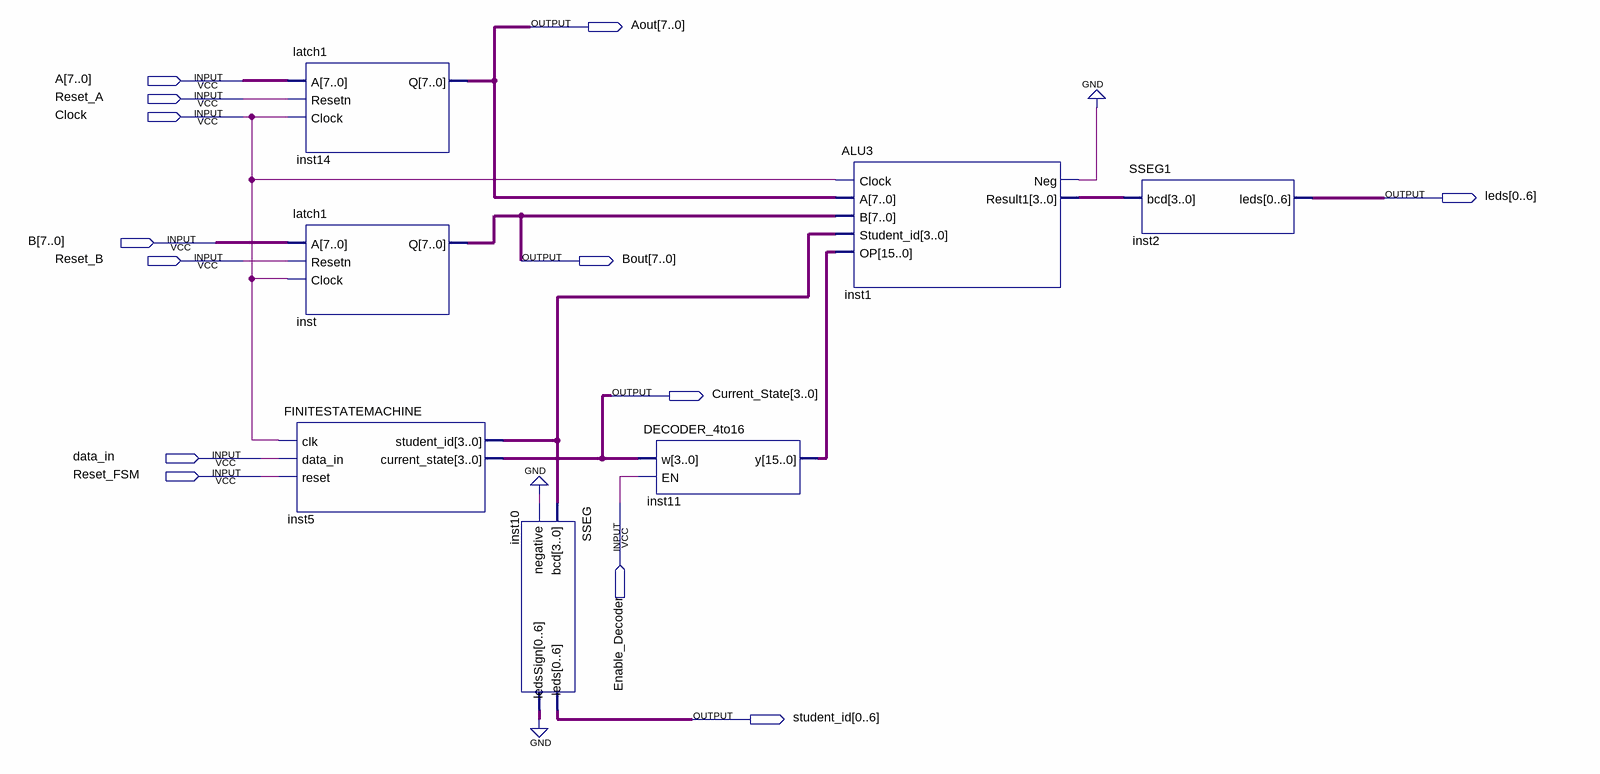
[diagram p0: schematic sheet]
// Quartus schematic PROBLEMSET3.bdf as structural Verilog: 7 symbols, 13 pins
module PROBLEMSET3 (
  input  [7:0] A,
  input  Reset_A,
  input  Clock,
  input  [7:0] B,
  input  Reset_B,
  input  data_in,
  input  Reset_FSM,
  input  Enable_Decoder,
  output [7:0] Aout,
  output [0:6] leds,
  output [7:0] Bout,
  output [3:0] Current_State,
  output [0:6] student_id
);

  wire inst1_neg;
  wire [3:0] inst1_result1, inst5_student_id;
  wire [6:0] inst10_ledssign;
  wire [15:0] inst11_y;

  latch1 inst14 (.A(A), .Resetn(Reset_A), .Clock(Clock), .Q(Aout));
  latch1 inst (.A(B), .Resetn(Reset_B), .Clock(Clock), .Q(Bout));
  FINITESTATEMACHINE inst5 (
    .clk(Clock), .data_in(data_in), .reset(Reset_FSM), .student_id(inst5_student_id),
    .current_state(Current_State));
  SSEG inst10 (.bcd(inst5_student_id), .negative(1'b0), .leds(student_id), .ledsSign(inst10_ledssign));
  DECODER_4to16 inst11 (.w(Current_State), .EN(Enable_Decoder), .y(inst11_y));
  ALU3 inst1 (
    .Clock(Clock), .A(Aout), .B(Bout), .Student_id(inst5_student_id), .OP(inst11_y), .Neg(inst1_neg),
    .Result1(inst1_result1));
  SSEG1 inst2 (.bcd(inst1_result1), .leds(leds));
  // also tied to GND on the sheet: {inst10_ledssign[0], inst10_ledssign[1], inst10_ledssign[2], inst10_ledssign[3], inst10_ledssign[4], inst10_ledssign[5], inst10_ledssign[6], inst1_neg}
endmodule
